# EAGLE design rev2 (EAGLE 6.5.0)
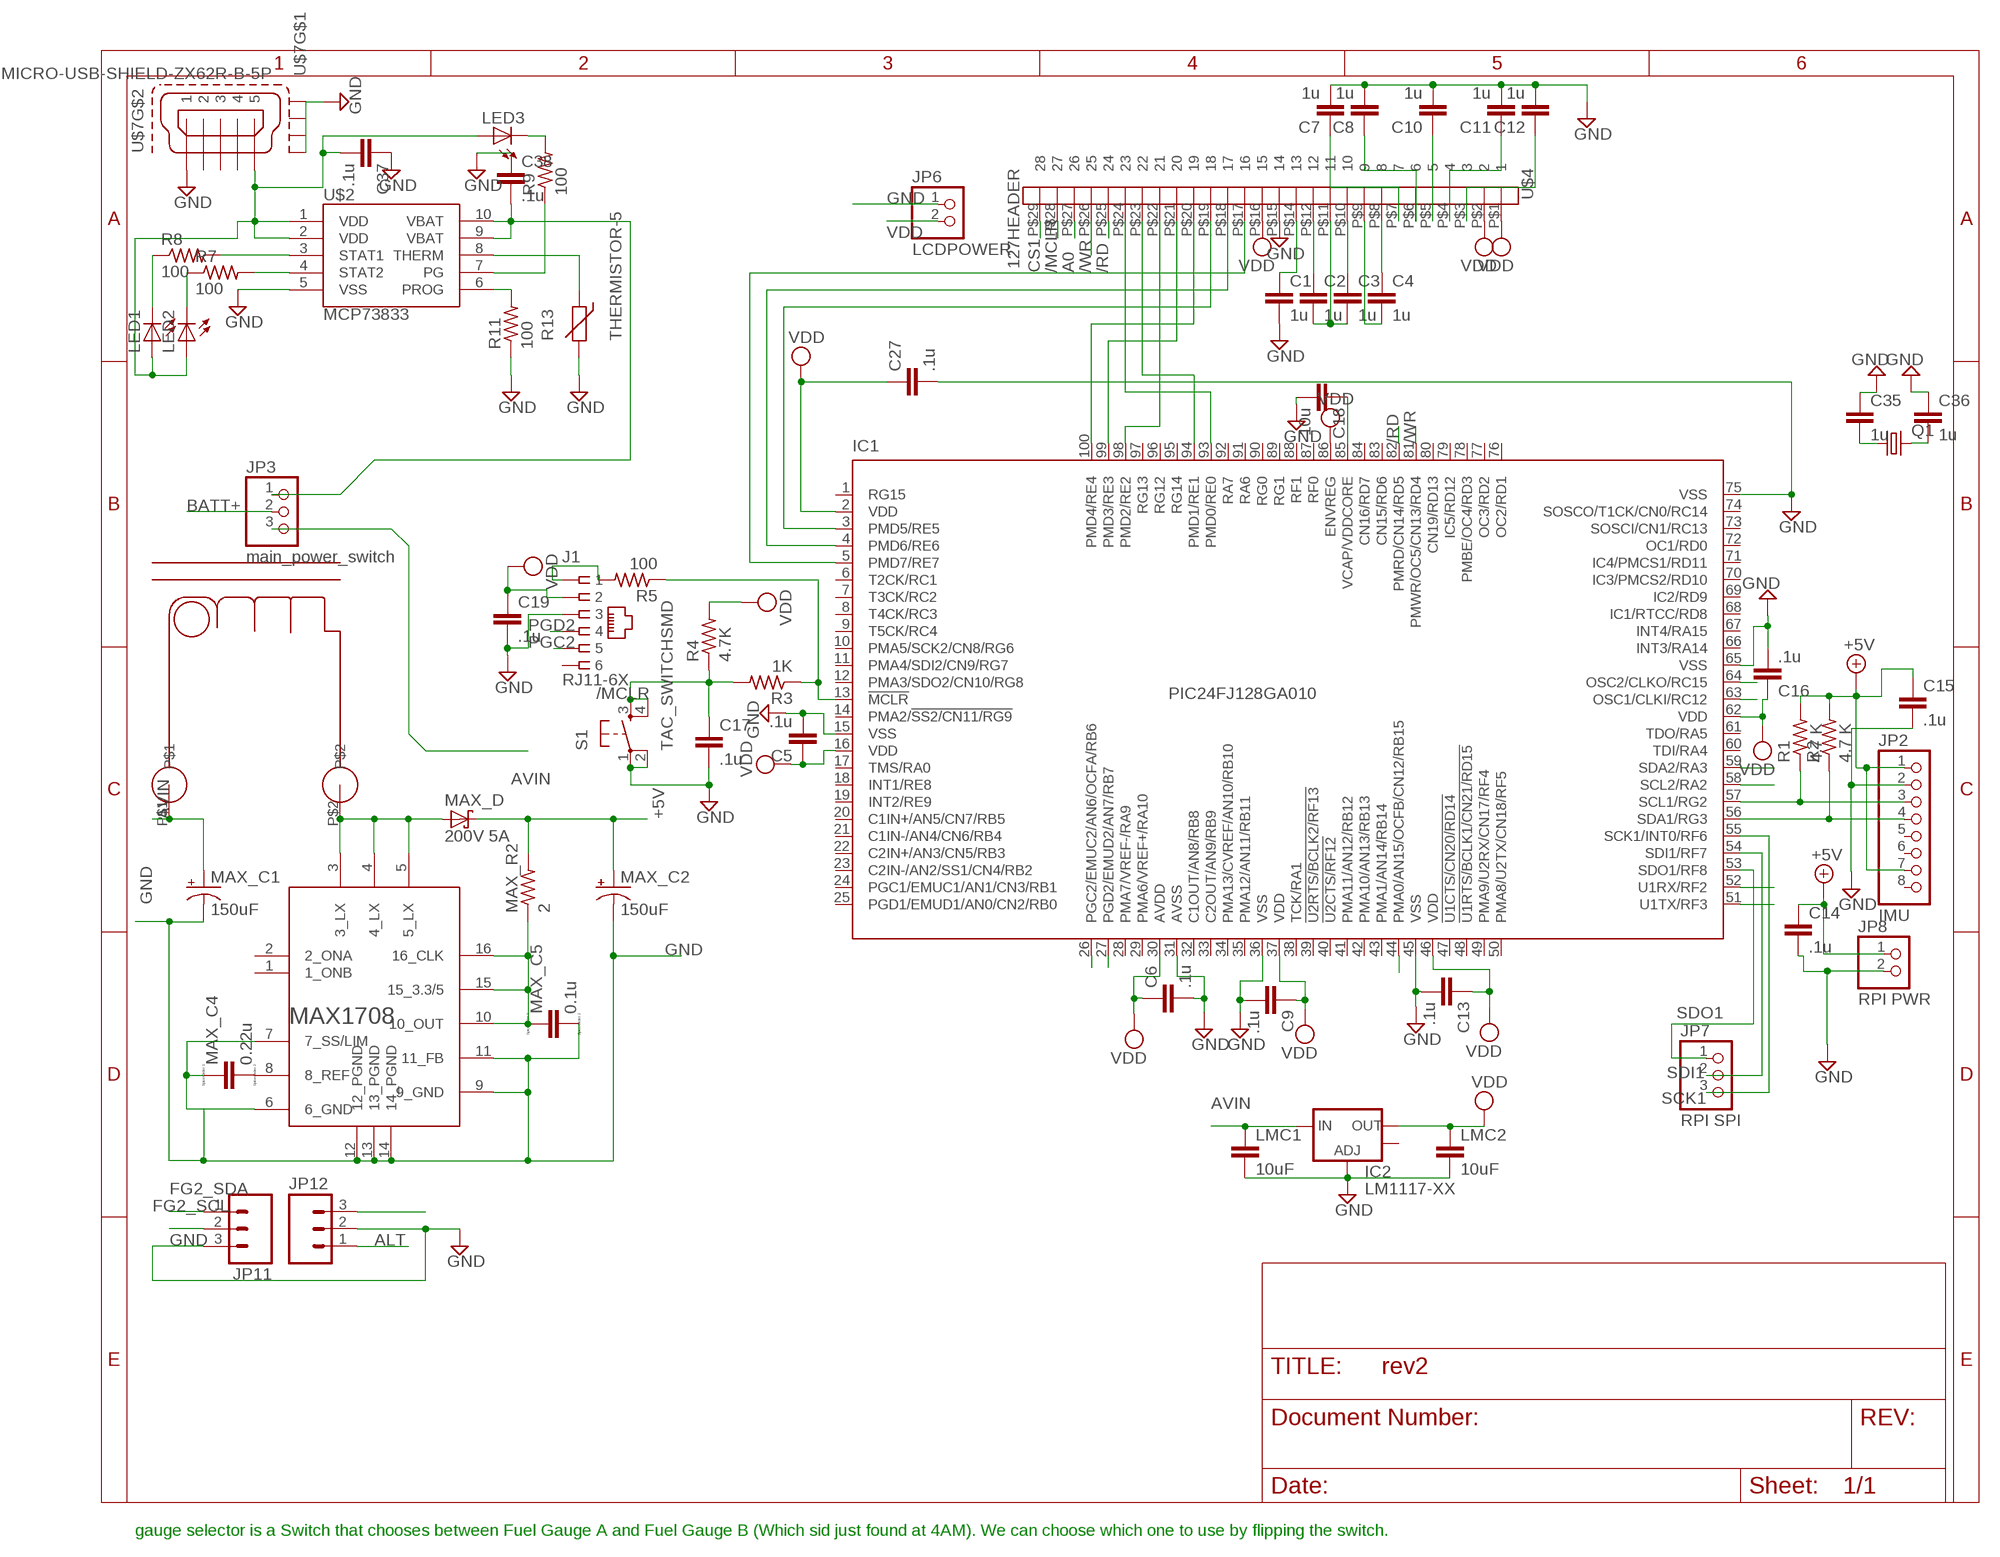
[diagram p0: schematic, sheet 1]

## Parts
C1  1u  C-EUC1206  [C1206]
C2  1u  C-EUC1206  [C1206]
C3  1u  C-EUC1206  [C1206]
C4  1u  C-EUC1206  [C1206]
C5  .1u  C-EUC1206  [C1206]
C6  .1u  C-EUC1206  [C1206]
C7  1u  C-EUC1206  [C1206]
C8  1u  C-EUC1206  [C1206]
C9  .1u  C-EUC1206  [C1206]
C10  1u  C-EUC1206  [C1206]
C11  1u  C-EUC1206  [C1206]
C12  1u  C-EUC1206  [C1206]
C13  .1u  C-EUC1206  [C1206]
C14  .1u  C-EUC1206  [C1206]
C15  .1u  C-EUC1206  [C1206]
C16  .1u  C-EUC1206  [C1206]
C17  .1u  C-EUC1206  [C1206]
C18  10u  C-EUC1206  [C1206]
C19  .1u  C-EUC1206  [C1206]
C27  .1u  C-EUC1206  [C1206]
C35  1u  C-EUC1206  [C1206]
C36  1u  C-EUC1206  [C1206]
C37  .1u  C-EUC1206  [C1206]
C38  .1u  C-EUC1206  [C1206]
IC1  PIC24FJ128GA010  [TQFP100-14X14]
IC2  LM1117-XX  V_REG_LM1117SOT223  [SOT223]
J1  RJ11-6X  [RJ11-NO_SHIELD]
JP2  IMU  PINHD-1X8  [1X08]
JP3  main_power_switch  PINHD-1X3  [1X03]
JP6  LCDPOWER  PINHD-1X2  [1X02]
JP7  RPI SPI  PINHD-1X3  [1X03]
JP8  RPI PWR  PINHD-1X2  [1X02]
JP11  M03PTH  [1X03]
JP12  M03PTH  [1X03]
LED1  LEDSMT1206  [1206]
LED2  LEDSMT1206  [1206]
LED3  LEDSMT1206  [1206]
LMC1  10uF  C-EUC1206  [C1206]
LMC2  10uF  C-EUC1206  [C1206]
MAX_C1  150uF  CPOL-USCT7343  [CT7343]
MAX_C2  150uF  CPOL-USCT7343  [CT7343]
MAX_C4  0.22u  CC1206  [C1206]
MAX_C5  0.1u  CC1206  [C1206]
MAX_D  200V 5A  SCHOTTKY-DIODESMC  [SMC]
MAX_R2  2  R-US_R1206  [R1206]
Q1  CRYTALHC49U-V  [HC49U-V]
R1  4.7 K  R-US_R1206  [R1206]
R2  4.7 K  R-US_R1206  [R1206]
R3  1K  R-US_R1206  [R1206]
R4  4.7K  R-US_R1206  [R1206]
R5  100  R-US_R1206  [R1206]
R7  100  R-US_R1206  [R1206]
R8  100  R-US_R1206  [R1206]
R9  100  R-US_R1206  [R1206]
R11  100  R-US_R1206  [R1206]
R13  THERMISTOR-5  [R-5]
S1  TAC_SWITCHSMD  [TACTILE-SWITCH-SMD]
U$2  MCP73833  [MSOP10]
U$3  MAX1708  [QSOP16]
U$4  127HEADER  [1.27HEADER]
U$6  UP2B-2R2-R  [UP2B-2R2-R]
U$7  MICRO-USB-SHIELD-ZX62R-B-5P  [ZX62R-B-5P]

## Nets
+5V: C14.1 C15.1 JP2.1 JP2.7 JP8.1 MAX_C2.+ MAX_D.C MAX_R2.2 R1.2 R2.2
/MCLR: C17.1 R3.2 R4.1 S1.3 S1.4 U$4.P$28
/RD: IC1.82(PMRD/CN14/RD5) U$4.P$25
/WR: IC1.81(PMWR/OC5/CN13/RD4) U$4.P$26
A0: IC1.44(PMA0/AN15/OCFB/CN12/RB15) U$4.P$27
ALT: JP12.1
AVIN: IC2.3(IN) JP3.3 LMC1.1 MAX_C1.+ U$6.P$1
BATT+: JP3.2 JP12.3
CS1: U$4.P$29
DS_DATA: IC1.52(U1RX/RF2)
FG2_SCL: IC1.58(SCL2/RA2) JP11.2
FG2_SDA: IC1.59(SDA2/RA3) JP11.1
GND: C1.2 C5.2 C6.2 C7.2 C8.2 C9.2 C10.2 C11.2 C12.2 C13.2 C14.2 C15.2 C16.2 C17.2 C18.2 C19.2 C27.2 C35.1 C36.1 C37.1 C38.1 IC1.15(VSS) IC1.31(AVSS) IC1.36(VSS) IC1.45(VSS) IC1.65(VSS) IC1.75(VSS) IC2.1(ADJ) J1.3 JP2.2 JP6.1 JP8.2 JP11.3 JP12.2 LMC1.2 LMC2.2 MAX_C1.- MAX_C2.- MAX_C4.1 MAX_C5.2 R11.1 R13.2 S1.1 S1.2 U$2.5(VSS) U$3.6(6_GND) U$3.7(7_SS/LIM) U$3.9(9_GND) U$3.11(11_FB) U$3.12(12_PGND) U$3.13(13_PGND) U$3.14(14_PGND) U$4.P$15 U$7.1 U$7.M1(S1) U$7.M2(S2) U$7.M3(S3) U$7.M4(S4)
N$1: IC1.57(SCL1/RG2) JP2.3 R1.1
N$2: IC1.56(SDA1/RG3) JP2.4 R2.1
N$3: LED1.C R8.1
N$4: IC1.13(!MCLR) R3.1 R5.1
N$5: R8.2 U$2.3(STAT1)
N$6: R7.2 U$2.4(STAT2)
N$7: C18.1 IC1.85(VCAP/VDDCORE)
N$8: IC1.5(PMD7/RE7) U$4.P$17
N$9: IC1.4(PMD6/RE6) U$4.P$18
N$10: IC1.3(PMD5/RE5) U$4.P$19
N$11: IC1.100(PMD4/RE4) U$4.P$20
N$12: IC1.99(PMD3/RE3) U$4.P$21
N$13: IC1.98(PMD2/RE2) U$4.P$22
N$14: IC1.94(PMD1/RE1) U$4.P$23
N$15: IC1.93(PMD0/RE0) U$4.P$24
N$16: C7.1 U$4.P$7
N$17: C3.1 U$4.P$10
N$18: LED2.C R7.1
N$19: C2.1 U$4.P$12
N$20: C2.2 C3.2 U$4.P$11
N$21: C1.1 U$4.P$14
N$22: C4.2 U$4.P$9
N$23: C4.1 U$4.P$8
N$24: C8.1 U$4.P$6
N$25: C10.1 U$4.P$5
N$26: C11.1 U$4.P$4
N$27: C12.1 U$4.P$3
N$28: R9.1 U$2.7(PG)
N$29: J1.1 R5.2
N$32: LED3.C R9.2
N$33: R11.2 U$2.6(PROG)
N$34: R13.1 U$2.8(THERM)
N$35: MAX_D.A U$3.3(3_LX) U$3.4(4_LX) U$3.5(5_LX) U$6.P$2
N$38: MAX_C5.1 MAX_R2.1 U$3.10(10_OUT) U$3.15(15_3.3/5) U$3.16(16_CLK)
N$40: MAX_C4.2 U$3.8(8_REF)
N$51: C38.2 JP3.1 U$2.9(VBAT) U$2.10(VBAT)
OSC1: C36.2 IC1.63(OSC1/CLKI/RC12) Q1.2
OSC2: C35.2 IC1.64(OSC2/CLKO/RC15) Q1.1
PGC2: IC1.26(PGC2/EMUC2/AN6/OCFA/RB6) J1.5
PGD2: IC1.27(PGD2/EMUD2/AN7/RB7) J1.4
PIO: IC1.51(U1TX/RF3)
SCK1: IC1.55(SCK1/INT0/RF6) JP7.3
SDI1: IC1.54(SDI1/RF7) JP7.2
SDO1: IC1.53(SDO1/RF8) JP7.1
VDD: C5.1 C6.1 C9.1 C13.1 C16.1 C19.1 C27.1 IC1.2(VDD) IC1.16(VDD) IC1.30(AVDD) IC1.37(VDD) IC1.46(VDD) IC1.62(VDD) IC1.86(ENVREG) IC2.2(OUT) J1.2 JP6.2 LMC2.1 R4.2 U$4.P$1 U$4.P$2 U$4.P$16
VDDUSB: C37.2 LED1.A LED2.A LED3.A U$2.1(VDD) U$2.2(VDD) U$7.5
Unconnected: IC1.1(RG15) IC1.6(T2CK/RC1) IC1.7(T3CK/RC2) IC1.8(T4CK/RC3) IC1.9(T5CK/RC4) IC1.10(PMA5/SCK2/CN8/RG6) IC1.11(PMA4/SDI2/CN9/RG7) IC1.12(PMA3/SDO2/CN10/RG8) IC1.14(PMA2/!SS2/CN11/RG9) IC1.17(TMS/RA0) IC1.18(INT1/RE8) IC1.19(INT2/RE9) IC1.20(C1IN+/AN5/CN7/RB5) IC1.21(C1IN-/AN4/CN6/RB4) IC1.22(C2IN+/AN3/CN5/RB3) IC1.23(C2IN-/AN2/SS1/CN4/RB2) IC1.24(PGC1/EMUC1/AN1/CN3/RB1) IC1.25(PGD1/EMUD1/AN0/CN2/RB0) IC1.28(PMA7/VREF-/RA9) IC1.29(PMA6/VREF+/RA10) IC1.32(C1OUT/AN8/RB8) IC1.33(C2OUT/AN9/RB9) IC1.34(PMA13/CVREF/AN10/RB10) IC1.35(PMA12/AN11/RB11) IC1.38(TCK/RA1) IC1.39(!U2RTS/BCLK2/RF13) IC1.40(!U2CTS/RF12) IC1.41(PMA11/AN12/RB12) IC1.42(PMA10/AN13/RB13) IC1.43(PMA1/AN14/RB14) IC1.47(!U1CTS/CN20/RD14) IC1.48(!U1RTS/BCLK1/CN21/RD15) IC1.49(PMA9/U2RX/CN17/RF4) IC1.50(PMA8/U2TX/CN18/RF5) IC1.60(TDI/RA4) IC1.61(TDO/RA5) IC1.66(INT3/RA14) IC1.67(INT4/RA15) IC1.68(IC1/RTCC/RD8) IC1.69(IC2/RD9) IC1.70(IC3/PMCS2/RD10) IC1.71(IC4/PMCS1/RD11) IC1.72(OC1/RD0) IC1.73(SOSCI/CN1/RC13) IC1.74(SOSCO/T1CK/CN0/RC14) IC1.76(OC2/RD1) IC1.77(OC3/RD2) IC1.78(PMBE/OC4/RD3) IC1.79(IC5/RD12) IC1.80(CN19/RD13) IC1.83(CN15/RD6) IC1.84(CN16/RD7) IC1.87(RF0) IC1.88(RF1) IC1.89(RG1) IC1.90(RG0) IC1.91(RA6) IC1.92(RA7) IC1.95(RG14) IC1.96(RG12) IC1.97(RG13) IC2.4(OUT) J1.6 JP2.5 JP2.6 JP2.8 U$3.1(1_ONB) U$3.2(2_ONA) U$7.2 U$7.3 U$7.4

## Notes on the sheet
- gauge selector is a Switch that chooses between Fuel Gauge A and Fuel Gauge B (Which sid just found at 4AM). We can choose which one to use by flipping the switch.

## Library data of the parts
C1-C19 C27 C35-C38 LMC1 LMC2 = rcl:C-EU: CAPACITOR, European symbol
IC1 = microchip:PIC24FJ*GA010: 64/80/100-Pin General Purpose, 16-Bit Flash Microcontrollers Source: http://ww1.microchip.com/downloads/en/DeviceDoc/39747d.pdf; MPN: PIC24FJ128GA010-I/PT; OC_FARNELL: 1146522; OC_NEWARK: 56K7341
IC2 = SparkFun-PowerIC:V_REG_LM1117: Voltage Regulator LM1117 Standard adjustable voltage regulator but in SMD form. Spark Fun Electronics SKU : COM-00595; PROD_ID: VREG-08170
J1 = con-tycoelectronics:RJ11: CORCOM Modular RJ Jacks No Shield Source: www.tycoelectronics.com .. ENG_DS_1654001_1099_RJ_L_0507.pdf; MPN: RJ11-6X; OC_FARNELL: unknown; OC_NEWARK: 16R6089
JP2 = pinhead:PINHD-1X8: PIN HEADER
JP3 JP7 = pinhead:PINHD-1X3: PIN HEADER
JP6 JP8 = pinhead:PINHD-1X2: PIN HEADER
JP11 JP12 = SparkFun:M03: Header 3 Standard 3-pin 0.1" header. Use with straight break away headers (SKU : PRT-00116), right angle break away headers (PRT-00553), swiss pins (PRT-00743), machine pins (PRT-00117), and female headers (PRT-00115). Molex polarized connector foot print use with SKU : PRT-08232 with associated crimp pins and housings.
LED1-LED3 = led:LED: LED OSRAM: - CHIPLED LG R971, LG N971, LY N971, LG Q971, LY Q971, LO R971, LY R971 LH N974, LH R974 LS Q976, LO Q976, LY Q976 LO Q996 - Hyper CHIPLED LW Q18S LB Q993, LB Q99A, LB R99A - SideLED LS A670, LO A670, LY A670, LG A670, LP A670 LB A673, LV A673, LT A673, LW A673 LH A674 LY A675 LS A676, LA A676, LO A676, LY A676, LW A676 LS A679, LY A679, LG A679 - Hyper Micro SIDELED® LS Y876, LA Y876, LO Y876, LY Y876 LT Y87S - SmartLED LW L88C, LW L88S LB L89C, LB L89S, LG L890 LS L89K, LO L89K, LY L89K LS L896, LA L896, LO L896, LY L896 - TOPLED LS T670, LO T670, LY T670, LG T670, LP T670 LSG T670, LSP T670, LSY T670, LOP T670, LYG T670 LG T671, LOG T671, LSG T671 LB T673, LV T673, LT T673, LW T673 LH T674 LS T676, LA T676, LO T676, LY T676, LB T676, LH T676, LSB T676, LW T676 LB T67C, LV T67C, LT T67C, LS T67K, LO T67K, LY T67K, LW E67C LS E67B, LA E67B, LO E67B, LY E67B, LB E67C, LV E67C, LT E67C LW T67C LS T679, LY T679, LG T679 LS T770, LO T770, LY T770, LG T770, LP T770 LB T773, LV T773, LT T773, LW T773 LH T774 LS E675, LA E675, LY E675, LS T675 LS T776, LA T776, LO T776, LY T776, LB T776 LHGB T686 LT T68C, LB T68C - Hyper Mini TOPLED® LB M676 - Mini TOPLED Santana® LG M470 LS M47K, LO M47K, LY M47K Source: http://www.osram.convergy.de LUXEON: - LUMILED® LXK2-PW12-R00, LXK2-PW12-S00, LXK2-PW14-U00, LXK2-PW14-V00 LXK2-PM12-R00, LXK2-PM12-S00, LXK2-PM14-U00 LXK2-PE12-Q00, LXK2-PE12-R00, LXK2-PE12-S00, LXK2-PE14-T00, LXK2-PE14-U00 LXK2-PB12-K00, LXK2-PB12-L00, LXK2-PB12-M00, LXK2-PB14-N00, LXK2-PB14-P00, LXK2-PB14-Q00 LXK2-PR12-L00, LXK2-PR12-M00, LXK2-PR14-Q00, LXK2-PR14-R00 LXK2-PD12-Q00, LXK2-PD12-R00, LXK2-PD12-S00 LXK2-PH12-R00, LXK2-PH12-S00 LXK2-PL12-P00, LXK2-PL12-Q00, LXK2-PL12-R00 Source: www.luxeon.com KINGBRIGHT: KA-3528ASYC Source: www.kingbright.com
MAX_C1 MAX_C2 = rcl:CPOL-US: POLARIZED CAPACITOR, American symbol
MAX_C4 MAX_C5 = eagle-ltspice:C: CAPACITOR, European symbol; SPICEMODEL: NONE; SPICEPREFIX: C
MAX_D = diode:SCHOTTKY-DIODE: Schottky Diode
MAX_R2 = adafruit:R-US_: RESISTOR, American symbol
Q1 = crystal:CRYTAL: CRYSTAL
R1-R5 R7-R9 R11 = rcl:R-US_: RESISTOR, American symbol
R13 = varistor:THERMISTOR: THERMISTOR
S1 = SparkFun-Retired:TAC_SWITCH: Momentary Switch Button commonly used for reset or general input. Spark Fun Electronics SKU : COM-00097 SMT- SWCH-08247; PROD_ID: SWCH-08247
U$2 = fuelgauge:MCP73833
U$3 = max1708:MAX1708
U$4 = fuelgauge:127HEADER
U$6 = duckgauge:UP2B-2R2-R: Yeah yeah inducktor
U$7 = con-hirose:MICRO-USB-SHIELD-: Hirose Micro USB Connector ZX62R-B-5P: Micro B, reverse (top mount) shell SMT Supplier: DigiKey H11574CT-ND Source: http://www.hirose.co.jp/cataloge_hp/e24200011.pdf

## Board
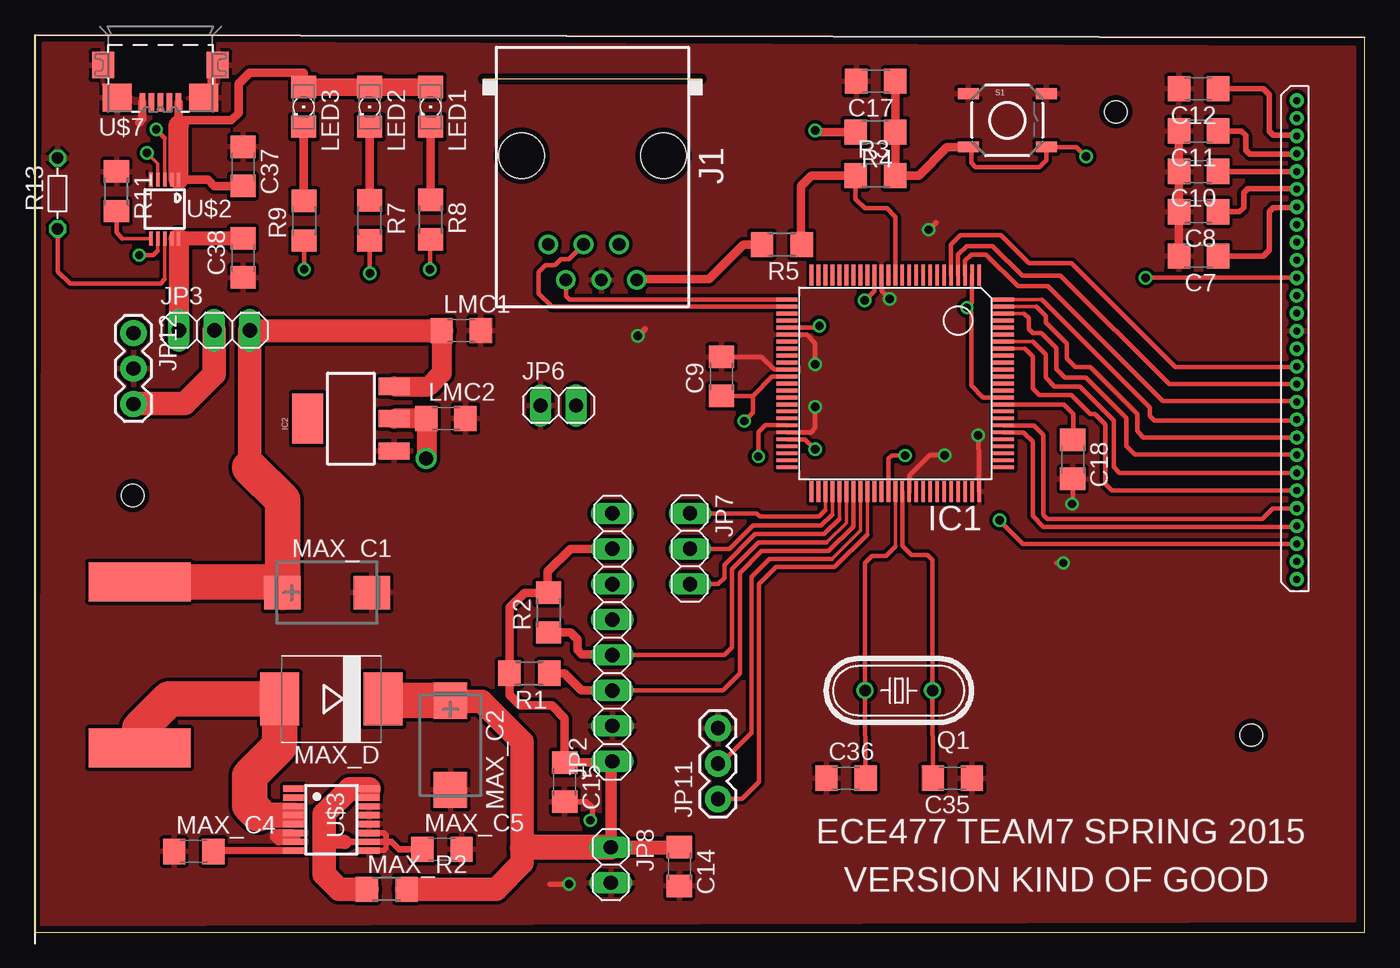
[diagram p1: board, top side]
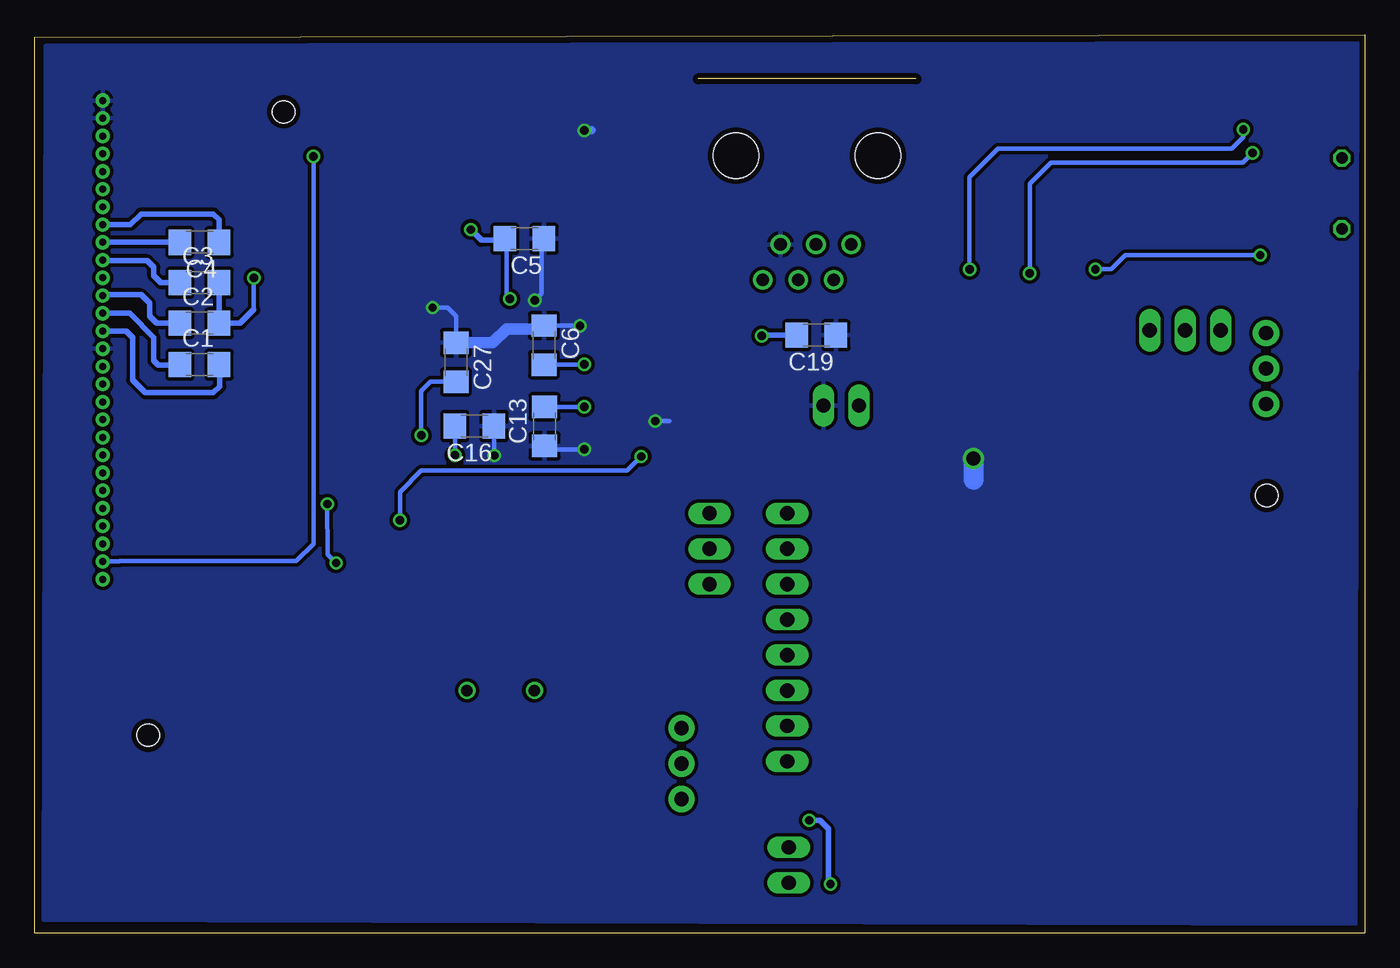
[diagram p2: board, bottom side, seen from below]

Size 95.23 x 64.31 mm. Coordinates in mm from the lower left corner, seen from the top.
Outline: 95.23,0 95.23,64.16 0,64.31 0,0 95.23,0
Copper layers (1*16): Top 0.0356mm / dielectric 1.5011mm / Bottom 0.0356mm
Design rules "ECE_Senior_Design": minimum track width 8mil, minimum drill 13mil, track to track 8mil, track to pad 8mil, pad to pad 6mil, via to via 8mil, smd to smd 6mil, copper to edge 15mil, drill to drill 8mil, minimum pad ring 7mil, minimum via ring 7mil, stop-mask expansion 3mil, vias tented up to drill 0mil, thermal gap 10mil
Holes 1.6 mm at 87.12,14.15 77.42,58.8 7.01,31.32

### Footprints (pad centres in the part's own frame; a part is rotated, then mirrored left to right if it is on the bottom)
C1206 = smd 1.6 x 1.8: 1 -1.4,0; 2 1.4,0
TQFP100-14X14 = smd 0.27 x 1.5: 1 -6,-7.75; 2 -5.5,-7.75; 3 -5,-7.75; 4 -4.5,-7.75; 5 -4,-7.75; 6 -3.5,-7.75; 7 -3,-7.75; 8 -2.5,-7.75; 9 -2,-7.75; 10 -1.5,-7.75; 11 -1,-7.75; 12 -0.5,-7.75; 13 0,-7.75; 14 0.5,-7.75; 15 1,-7.75; 16 1.5,-7.75; 17 2,-7.75; 18 2.5,-7.75; 19 3,-7.75; 20 3.5,-7.75; 21 4,-7.75; 22 4.5,-7.75; 23 5,-7.75; 24 5.5,-7.75; 25 6,-7.75; 51 6,7.75; 52 5.5,7.75; 53 5,7.75; 54 4.5,7.75; 55 4,7.75; 56 3.5,7.75; 57 3,7.75; 58 2.5,7.75; 59 2,7.75; 60 1.5,7.75; 61 1,7.75; 62 0.5,7.75; 63 0,7.75; 64 -0.5,7.75; 65 -1,7.75; 66 -1.5,7.75; 67 -2,7.75; 68 -2.5,7.75; 69 -3,7.75; 70 -3.5,7.75; 71 -4,7.75; 72 -4.5,7.75; 73 -5,7.75; 74 -5.5,7.75; 75 -6,7.75 | smd 1.5 x 0.27: 26 7.75,-6; 27 7.75,-5.5; 28 7.75,-5; 29 7.75,-4.5; 30 7.75,-4; 31 7.75,-3.5; 32 7.75,-3; 33 7.75,-2.5; 34 7.75,-2; 35 7.75,-1.5; 36 7.75,-1; 37 7.75,-0.5; 38 7.75,0; 39 7.75,0.5; 40 7.75,1; 41 7.75,1.5; 42 7.75,2; 43 7.75,2.5; 44 7.75,3; 45 7.75,3.5; 46 7.75,4; 47 7.75,4.5; 48 7.75,5; 49 7.75,5.5; 50 7.75,6; 76 -7.75,6; 77 -7.75,5.5; 78 -7.75,5; 79 -7.75,4.5; 80 -7.75,4; 81 -7.75,3.5; 82 -7.75,3; 83 -7.75,2.5; 84 -7.75,2; 85 -7.75,1.5; 86 -7.75,1; 87 -7.75,0.5; 88 -7.75,0; 89 -7.75,-0.5; 90 -7.75,-1; 91 -7.75,-1.5; 92 -7.75,-2; 93 -7.75,-2.5; 94 -7.75,-3; 95 -7.75,-3.5; 96 -7.75,-4; 97 -7.75,-4.5; 98 -7.75,-5; 99 -7.75,-5.5; 100 -7.75,-6
SOT223 = smd 1.219 x 2.235: 1 -2.311,-3.099; 2 0,-3.099; 3 2.311,-3.099 | smd 3.6 x 2.2: 4 0,3.099
RJ11-NO_SHIELD = drill 0.9 pad 1.4: 1 -3.175,8.89; 2 -1.905,6.35; 3 -0.635,8.89; 4 0.635,6.35; 5 1.905,8.89; 6 3.175,6.35 | hole 3.251: -5.08,0; 5.08,0
1X08 = drill 1.016 long: 1 -8.89,0; 2 -6.35,0; 3 -3.81,0; 4 -1.27,0; 5 1.27,0; 6 3.81,0; 7 6.35,0; 8 8.89,0
1X03 = drill 1.016 long: 1 -2.54,0; 2 0,0; 3 2.54,0
1X02 = drill 1.016 long: 1 -1.27,0; 2 1.27,0
1X03' = drill 1.016 pad 1.88: 1 0,0; 2 2.54,0; 3 5.08,0
1206 = smd 1.6 x 1.803: A -1.422,0; C 1.422,0
CT7343 = smd 2.6 x 2.4: + -3.2,0; - 3.2,0
SMC = smd 2.8 x 3.8: A 3.7,0; C -3.7,0
R1206 = smd 1.6 x 1.803: 1 -1.422,0; 2 1.422,0
HC49U-V = drill 0.813: 1 -2.413,0; 2 2.413,0
R-5 = drill 0.813 octagon: 1 -2.54,0; 2 2.54,0
TACTILE-SWITCH-SMD = smd 1.524 x 0.762: 1 -2.794,1.905; 2 2.794,1.905; 3 -2.794,-1.905; 4 2.794,-1.905
MSOP10 = smd 0.25 x 1: 1 -1,-2.113; 2 -0.5,-2.113; 3 0,-2.113; 4 0.5,-2.113; 5 1,-2.113; 6 1,2.113; 7 0.5,2.113; 8 0,2.113; 9 -0.5,2.113; 10 -1,2.113
QSOP16 = smd 0.45 x 1.5: 1 -2.223,-2.69; 2 -1.587,-2.69; 3 -0.953,-2.69; 4 -0.318,-2.69; 5 0.318,-2.69; 6 0.953,-2.69; 7 1.587,-2.69; 8 2.223,-2.69; 9 2.223,2.69; 10 1.587,2.69; 11 0.953,2.69; 12 0.318,2.69; 13 -0.318,2.69; 14 -0.953,2.69; 15 -1.587,2.69; 16 -2.223,2.69
1.27HEADER = drill 0.5 pad 1.016: P$1 0.406,0.457; P$2 1.676,0.457; P$3 2.946,0.457; P$4 4.216,0.457; P$5 5.486,0.457; P$6 6.756,0.457; P$7 8.026,0.457; P$8 9.296,0.457; P$9 10.566,0.457; P$10 11.836,0.457; P$11 13.106,0.457; P$12 14.376,0.457; P$14 15.646,0.457; P$15 16.916,0.457; P$16 18.186,0.457; P$17 19.456,0.457; P$18 20.726,0.457; P$19 21.996,0.457; P$20 23.266,0.457; P$21 24.536,0.457; P$22 25.806,0.457; P$23 27.076,0.457; P$24 28.346,0.457; P$25 29.616,0.457; P$26 30.886,0.457; P$27 32.156,0.457; P$28 33.426,0.457; P$29 34.696,0.457
UP2B-2R2-R = smd 2.8 x 7.3: P$1 -19.27,1; P$2 -7.365,1
ZX62R-B-5P = smd 1.35 x 0.4: 1 2.675,-1.3; 2 2.675,-0.65; 3 2.675,0; 4 2.675,0.65; 5 2.675,1.3 | smd 1.9 x 1.6: M1 0,-4.1; M2 0,4.1 | smd 2 x 2.1: M3 2.35,3.1; M4 2.35,-3.1

### Placement (x,y rotation side)
C1  83.44,40.69 0 bottom
C2  83.44,43.66 0 bottom
C3  83.44,46.56 0 bottom
C4  83.44,49.45 180 bottom
C5  60.17,49.71 180 bottom
C6  58.78,42.09 270 bottom
C7  83.34,48.46 180 top
C8  83.34,51.64 180 top
C9  49.17,39.85 90 top
C10  83.34,54.53 180 top
C11  83.34,57.43 180 top
C12  83.34,60.45 180 top
C13  58.72,36.27 90 bottom
C14  46.15,4.75 270 top
C15  37.95,10.79 270 top
C16  63.75,36.3 180 bottom
C17  60.22,60.99 180 top
C18  74.32,33.91 270 top
C19  39.27,42.8 180 bottom
C27  65.07,40.87 270 bottom
C35  65.71,11.07 180 top
C36  58.09,11.07 0 top
C37  14.91,54.89 270 top
C38  14.91,48.34 90 top
IC1  61.62,39.34 180 top
IC2  22.63,36.83 90 top
J1  39.93,55.65 180 top
JP2  41.35,21.16 90 top
JP3  12.85,43.15 0 top
JP6  37.49,37.77 0 top
JP7  46.91,27.51 270 top
JP8  41.25,4.85 270 top
JP11  [1X03']  48.92,9.58 90 top
JP12  [1X03']  7.06,42.95 270 top
LED1  28.35,59.16 270 top
LED2  23.98,59.16 270 top
LED3  19.25,59.16 270 top
LMC1  30.53,43.13 0 top
LMC2  29.44,36.83 0 top
MAX_C1  20.93,24.36 0 top
MAX_C2  29.77,13.44 270 top
MAX_C4  11.38,5.82 0 top
MAX_C5  29.16,5.97 0 top
MAX_D  21.23,16.74 180 top
MAX_R2  25.2,3.12 0 top
Q1  61.87,17.35 180 top
R1  35.41,18.59 180 top
R2  36.78,22.94 90 top
R3  60.2,54.23 0 top
R4  60.2,57.35 180 top
R5  53.49,49.3 180 top
R7  23.98,51.03 270 top
R8  28.35,51.08 270 top
R9  19.28,51 90 top
R11  5.84,53.11 270 top
R13  1.63,52.96 90 top
S1  69.65,58.19 0 top
U$2  9.3,51.84 180 top
U$3  21.23,8.1 270 top
U$4  89.92,60.02 270 top
U$6  6.5,5.87 270 top
U$7  8.99,62.15 270 top

### Tracks (layer width: path | path; a pad name or v marks a point on that pad's centre or on a via)
+5V
  Top 0.61: 41.27,12.19 JP2.1 41.28,12.19 C15.1 37.95,15.37 37.03,16.28 34.75,16.28 33.98,17.04 R1.2 | JP2.7 38.35,27.51 36.73,25.88 36.73,24.41 R2.2 35.05,24.36 33.98,23.29 R1.2 | R1.2
  Top 0.813: 41.27,12.19 41.27,9.3 JP8.1
  Top 1.016: JP8.1 46.12,6.12 C14.1
  Top 1.676: MAX_R2.2 33.02,3.12 34.9,5 34.9,6.07 34.9,13.69 32,16.59 29.82,16.59 MAX_C2.+
  Top 1.778: JP8.1 34.95,6.12 34.9,6.07
  Top 2.54: MAX_C2.+ 25.04,16.64 MAX_D.C
/MCLR  (via drill 0.6)
  Top 0.305: S1.3 67.06,56.08 67.06,55.14 67.36,54.84 71.93,54.84 72.44,55.35 S1.4 74.6,56.29 v75.29,55.6
  Top 0.61: S1.3 66.83,56.26 65.33,56.26 63.3,54.23 R3.2 R4.1 C17.1
  Bottom 0.305: v75.29,55.6 75.29,27.86 76.5,26.64 89.15,26.64 89.2,26.59 U$4.P$28
/RD
  Top 0.305: IC1.82 71.53,36.34 72.24,35.64 72.24,29.92 72.52,29.64 87.91,29.64 88.67,30.4 U$4.P$25
/WR
  Top 0.305: IC1.81 70.81,35.84 71.48,35.18 71.48,29.84 72.24,29.08 90.32,29.08 U$4.P$26
A0  (via drill 0.6)
  Top 0.305: U$4.P$27 70.76,27.86 v69.09,29.54 | v51.82,34.11 51.82,35.86 52.32,36.37 53.84,36.37 IC1.44
  Bottom 0.305: v69.09,29.54 69.09,31.57 67.56,33.1 52.83,33.1 v51.82,34.11
AVIN
  Top 1.422: IC2.3 28.19,39.14 29.13,40.08 LMC1.1
  Top 1.676: 15.39,33.32 JP3.3 15.44,43.1 LMC1.1
  Top 2.54: MAX_C1.+ 17.73,25.27 | 17.73,25.27 17.73,30.99 15.39,33.32 | U$6.P$1 17.59,25.14 17.73,25.27
BATT+
  Top 1.676: JP3.2 12.85,40 10.74,37.9 7.09,37.9 JP12.3
FG2_SCL
  Top 0.254: IC1.58 59.12,28.82 57.07,26.77
  Top 0.305: 57.07,26.77 52.6,26.77 51.31,25.48 51.31,14.3 49.28,12.27 49.07,12.12 JP11.2
FG2_SDA
  Top 0.254: IC1.59 59.62,28.53
  Top 0.305: 59.62,28.53 57.28,26.19 53.06,26.19 51.87,24.99 51.87,10.79 50.65,9.58 JP11.1
GND  (via drill 0.6)
  Top 0.254: 62.64,31.01 62.64,31.58 IC1.65
  Top 0.305: IC1.36 52.95,40.34 52.05,41.25 50.7,41.25 C9.2 | IC1.15 60.62,46.01 v61.21,45.42 | IC1.31 55.28,42.84 55.88,42.24 v55.88,40.72 | IC1.45 55.58,35.84 55.88,36.14 v55.88,37.67 | IC1.75 67.62,33.55 v67.56,35.64 | v65.15,34.21 64.11,34.21 62.64,32.74 62.64,31.58 | C18.2 74.32,30.96 v74.3,30.71 | v73.66,26.49 73.15,26.49
  Top 0.406: v64.01,50.37 64.52,50.88 | v43.18,42.75 43.69,43.26 | U$3.11 24.98,7.15 25.15,6.98 25.15,6.07 24.99,5.92 23.96,5.92 U$3.9 | C15.2 39.5,9.39 39.93,8.97 39.93,8.2 v39.78,8.05 | v38.25,3.48 36.88,3.48
  Top 0.508: U$3.6 17.23,7.15 17.07,6.98 17.07,6.83 17.37,6.53 17.53,6.53 | 18.59,6.53 17.53,6.53 | 17.53,6.53 17.22,6.83 18.75,6.83
  Top 0.61: C11.2 C10.2 C8.2 C7.2 | U$7.1 7.69,58.26 7.47,58.04 | U$7.M2 13.09,62.14 12.65,61.7 12.65,60.02 12.31,60.02 U$7.M3
  Bottom 0.305: v61.21,45.42 61.21,45.54 61.47,45.8 61.47,49.6 C5.2 | v55.88,40.72 58.75,40.72 C6.2 | v55.88,37.67 C13.2 | v67.56,35.64 67.56,38.79 66.88,39.47 C27.2 | C16.2 v65.15,34.22 v65.15,34.21 | v74.3,30.71 74.27,27.1 v73.66,26.49
  Bottom 0.406: U$4.P$15 88.7,43.1 88.24,42.65 88.24,39.6 87.33,38.68 82.45,38.68 81.99,39.14 81.99,40.64 C1.2 | 61.47,49.6 63.24,49.6 v64.01,50.37 | C19.2 43.13,42.8 v43.18,42.75 | v39.78,8.05 39.01,8.05 38.41,7.44 38.41,3.63 v38.25,3.48
  pour Top (isolate 0.254): 0.66,63.68 94.44,63.37 94.44,0.94 0.51,0.63
N$1
  Top 0.305: IC1.57 58.62,29.11 56.84,27.33 52.05,27.33 50.49,25.78 50.49,18.57 49.28,17.35 JP2.3
  Top 0.61: R1.1 37.92,18.59 39.17,17.35 JP2.3
N$2
  Top 0.254: IC1.56 58.12,29.37 56.69,27.94
  Top 0.305: 56.69,27.94 51.82,27.94 49.94,26.06 49.94,20.42 49.4,19.89 JP2.4
  Top 0.61: R2.1 38.35,21.51 38.86,21.01 38.86,20.24 39.17,19.94 41.3,19.94 JP2.4
N$3
  Top 0.61: LED1.C R8.1
N$4
  Top 0.305: R3.1 58.78,52.55 59.44,51.89 61.01,51.89 61.65,51.26 61.65,47.12 IC1.13
  Top 0.61: R3.1 55.63,54.23 54.86,53.47 54.86,49.35 R5.1
N$5  (via drill 0.6)
  Top 0.254: U$2.3 9.3,56.92
  Top 0.305: v28.3,47.52 28.3,49.61 R8.2 | 9.3,56.92 v8.69,57.53
  Bottom 0.305: v28.3,47.52 28.3,54.13 26.26,56.16 9.5,56.16 8.69,56.97 v8.69,57.53
N$6  (via drill 0.6)
  Top 0.254: U$2.4 8.8,55.08 v8.03,55.85
  Top 0.305: v23.98,47.24 R7.2
  Bottom 0.305: v23.98,47.24 23.98,53.64 22.48,55.14 8.74,55.14 v8.03,55.85
N$7
  Top 0.305: IC1.85 73.69,37.84 74.37,37.16 74.37,35.36 C18.1
N$8
  Top 0.305: IC1.5 65.62,49.29 66.29,49.96 69.19,49.96 71.17,47.98 74.22,47.98 81.69,40.51 90.32,40.51 U$4.P$17
N$9
  Top 0.305: IC1.4 66.12,48.57 66.75,49.2 68.58,49.2 70.71,47.07 73.46,47.07 81.23,39.29 U$4.P$18
N$10
  Top 0.305: IC1.3 66.62,48.15 67.06,48.59 68.12,48.59 70.41,46.3 72.54,46.3 80.77,38.07 90.32,38.07 U$4.P$19
N$11
  Top 0.254: IC1.100 72.13,45.34
  Top 0.305: 72.13,45.34 79.86,37.62 79.86,37.01 80.16,36.7 90.32,36.7 U$4.P$20
N$12
  Top 0.254: IC1.99 71.72,44.84
  Top 0.305: 71.72,44.84 72.39,44.17 72.39,43.71 73.91,42.19 73.91,41.12 74.52,40.51 75.59,40.51 78.94,37.16 78.94,35.94 79.4,35.48 U$4.P$21
N$13
  Top 0.254: IC1.98 70.84,44.34
  Top 0.305: 70.84,44.34 71.17,44.02 71.17,43.26 71.48,42.95 72.08,42.95 73.15,41.88 73.15,40.36 73.76,39.75 75.29,39.75 78.18,36.86 78.18,34.87 78.79,34.26 90.32,34.26 U$4.P$22
N$14
  Top 0.254: 71.48,42.34 IC1.94
  Top 0.305: U$4.P$23 77.67,32.94 77.27,33.35 77.27,36.7 74.83,39.14 73,39.14 72.39,39.75 72.39,41.43 71.48,42.34
N$15
  Top 0.254: IC1.93 70.91,41.84
  Top 0.305: 70.91,41.84 71.48,41.27 71.48,38.99 71.93,38.53 74.22,38.53 75.59,37.16 75.89,37.16 76.66,36.4 76.66,32.13 77.11,31.67 U$4.P$24
N$16
  Top 0.406: C7.1 87.96,48.46 88.39,48.89 88.39,51.64 88.7,51.94 90.32,51.94 U$4.P$7
N$17
  Bottom 0.406: C3.1 86.21,46.56 86.72,47.07 86.72,47.68 87.17,48.13 90.32,48.13 U$4.P$10
N$18
  Top 0.61: LED2.C R7.1
N$19
  Bottom 0.406: C2.1 86.51,43.66 87.02,44.17 87.02,45.08 87.63,45.69 90.32,45.69 U$4.P$12
N$20  (via drill 0.6)
  Top 0.305: U$4.P$11 v79.55,46.91
  Bottom 0.305: v79.55,46.91 79.55,44.63
  Bottom 0.406: C3.2 C2.2 80.52,43.66 79.55,44.63
N$21
  Bottom 0.406: U$4.P$14 88.44,44.37 86.72,42.65 86.72,40.97 86.41,40.67 84.86,40.67 C1.1
N$22
  Bottom 0.406: C4.2 U$4.P$9
N$23
  Bottom 0.406: C4.1 82.04,51.08 82.45,51.49 87.63,51.49 88.39,50.72 U$4.P$8
N$24
  Top 0.406: C8.1 86.26,51.64 86.56,51.94 86.56,53.01 86.87,53.31 90.32,53.31 U$4.P$6
N$25
  Top 0.406: C10.1 U$4.P$5
N$26
  Top 0.406: C11.1 86.41,57.43 86.72,57.12 86.72,56.06 87.02,55.75 90.32,55.75 U$4.P$4
N$27
  Top 0.406: C12.1 87.96,60.45 88.39,60.02 88.39,57.43 88.7,57.12 90.32,57.12 U$4.P$3
N$28  (via drill 0.6)
  Top 0.254: U$2.7 8.8,48.85
  Top 0.305: 8.8,48.85 8.48,48.54 v7.47,48.54 | v19.28,47.52 R9.1
  Bottom 0.305: v7.47,48.54 17.12,48.54 18.14,47.52 v19.28,47.52
N$29
  Top 0.61: J1.1 43.16,46.81 48.26,46.81 50.75,49.3 R5.2
N$30  (via drill 0.6)
  other vias: 39.78,8.05
N$32
  Top 0.61: LED3.C 19.25,53.01 R9.2
N$33
  Top 0.254: U$2.6 6.25,49.73
  Top 0.305: 6.25,49.73 5.84,50.14 R11.2
N$34
  Top 0.254: U$2.8 9.3,46.81
  Top 0.305: 9.3,46.81 8.99,46.51 2.52,46.51 1.65,47.37 1.65,50.39 R13.1
N$35
  Top 0.406: U$3.3 U$3.4 U$3.5
  Top 1.778: U$3.4 16.09,8.42 15.93,8.59
  Top 2.54: U$6.P$2 7.5,14.64 9.6,16.74 MAX_D.A 17.53,13.39 15.39,11.25 15.39,9.12 15.93,8.59 16,8.51
N$38
  Top 0.406: 20.27,8.81 21.78,10.33 U$3.16 U$3.15
  Top 0.457: MAX_C5.1 26.09,5.97 25.54,6.51 U$3.10 23.91,6.5 22.2,6.5
  Top 1.016: 22.2,6.5 20.75,6.5 20.73,6.53
  Top 1.676: U$3.16 22.54,10.33 20.73,8.51 20.73,6.53 20.73,4.19 21.79,3.12 MAX_R2.1
N$40
  Top 0.508: U$3.8 12.84,5.88 MAX_C4.2
N$51
  Top 0.254: 10.3,49.74 9.8,49.74
  Top 0.406: 9.8,49.74 U$2.9
  Top 0.61: 10.3,49.74 U$2.10
  Top 1.016: C38.2 10.3,49.74
  Top 1.422: U$2.10 10.3,43.17 JP3.1
OSC1
  Top 0.254: IC1.63 61.62,27.66
  Top 0.305: C36.2 59.46,17.2 Q1.2 59.44,23.47 59.44,26.49 59.94,27 60.96,27 61.62,27.66
OSC2
  Top 0.305: C35.2 64.29,17.19 Q1.1 64.29,26.7 63.93,27.05 62.76,27.05 62.12,27.69 IC1.64
PGC2
  Top 0.305: IC1.26 38.27,45.34 38.02,45.59 J1.5
PGD2
  Top 0.305: IC1.27 37.02,44.84 36.07,45.8 36.07,47.32 36.58,47.83 37.26,47.83 37.69,48.26 38.25,48.26 J1.4
SCK1
  Top 0.254: IC1.55 57.62,29.65
  Top 0.305: 57.62,29.65 56.52,28.55 51.59,28.55 49.38,26.34 49.38,25.43 48.92,24.97 JP7.3
SDI1
  Top 0.254: IC1.54 57.12,29.97
  Top 0.305: 57.12,29.97 56.31,29.16 51.41,29.16 49.76,27.51 JP7.2
SDO1
  Top 0.254: IC1.53 56.62,30.28
  Top 0.305: 56.62,30.28 56.16,29.82 51.92,29.82 51.69,30.05 JP7.1
VDD  (via drill 0.6, 1)
  Top 0.254: 61.14,31.61 IC1.62
  Top 0.305: IC1.2 67.12,45.15 v66.75,44.78 67.06,44.48 67.06,39.19 67.9,38.34 IC1.86 | 51.41,38.46 C9.1 | IC1.16 60.12,45.97 v59.44,45.29 | IC1.30 56.05,43.34 v56.19,43.48 | IC1.46 55.16,35.34 v55.88,34.62 | v62.33,34.19 61.37,34.19 61.14,33.96 61.14,31.61 | IC1.37 52.8,39.84 51.41,38.46 | 51.41,38.46 51.41,37.26 v50.8,36.65
  Top 0.61: R4.2 56.01,57.35 v55.88,57.48
  Top 1.422: IC2.2 LMC2.1 28.04,34.01 v28.02,33.99
  Bottom 0.305: v66.75,44.78 65.68,44.78 65.08,44.17 C27.1 | v59.44,45.29 58.93,45.8 58.93,49.55 C5.1 | v56.19,43.48 C6.1 | v55.88,34.62 58.47,34.62 C13.1 | C16.1 62.35,34.21 v62.33,34.19 | v50.8,36.65 49.78,36.65
  Bottom 0.61: v55.88,57.48 55.37,57.48
  Bottom 0.813: C27.1 62.46,42.27 61.47,43.26 58.42,43.26
  Bottom 1.422: v28.02,33.99 28.02,32.46
  pour Bottom (isolate 0.254): 0.51,63.73 94.44,63.53 94.59,0.94 0.66,0.63 0.66,1.09
VDDUSB
  Top 0.406: 10.29,58.19 10.29,57.88 | U$2.1 U$2.2
  Top 0.61: 10.29,57.88 10.31,57.86 | C37.2 12.86,53.49 12.39,53.95 U$2.1 | 10.36,58.19 14.07,58.19 14.58,58.7 14.58,60.81 15.37,61.59 19.24,61.59 LED3.A | 10.36,58.19 10.29,58.19 | U$7.5 10.29,58.26 10.36,58.19
  Top 1.27: LED1.A LED2.A LED3.A
  Top 1.422: U$2.1 10.3,57.85 10.31,57.86

### Text on the board
tNames: ECE477 TEAM7 SPRING 2015 | VERSION KIND OF GOOD